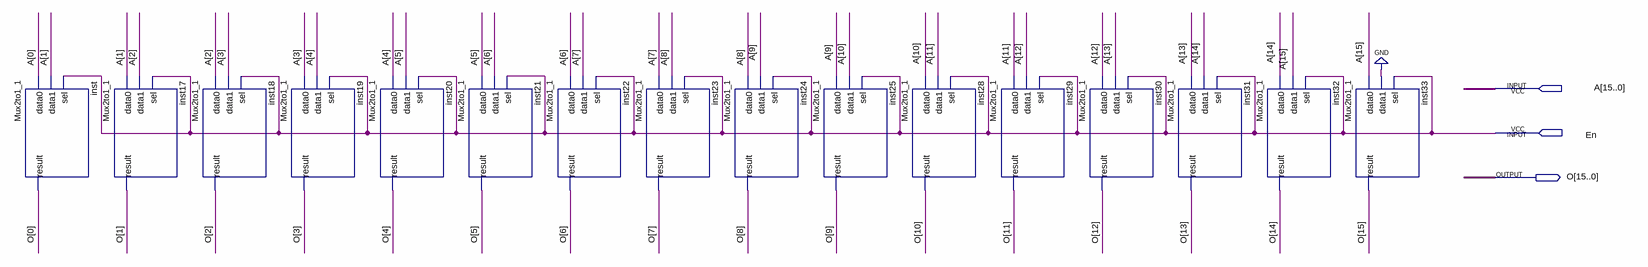
[diagram p0: schematic sheet]
// Quartus schematic shfr.bdf as structural Verilog: 16 symbols, 3 pins
module shfr (
  input  [15:0] A,
  input  En,
  output [15:0] O
);

  Mux2to1_1 inst (.data0(A[0]), .data1(A[1]), .sel(En), .result(O[0]));
  Mux2to1_1 inst17 (.data0(A[1]), .data1(A[2]), .sel(En), .result(O[1]));
  Mux2to1_1 inst18 (.data0(A[2]), .data1(A[3]), .sel(En), .result(O[2]));
  Mux2to1_1 inst19 (.data0(A[3]), .data1(A[4]), .sel(En), .result(O[3]));
  Mux2to1_1 inst20 (.data0(A[4]), .data1(A[5]), .sel(En), .result(O[4]));
  Mux2to1_1 inst21 (.data0(A[5]), .data1(A[6]), .sel(En), .result(O[5]));
  Mux2to1_1 inst22 (.data0(A[6]), .data1(A[7]), .sel(En), .result(O[6]));
  Mux2to1_1 inst23 (.data0(A[7]), .data1(A[8]), .sel(En), .result(O[7]));
  Mux2to1_1 inst24 (.data0(A[8]), .data1(A[9]), .sel(En), .result(O[8]));
  Mux2to1_1 inst25 (.data0(A[9]), .data1(A[10]), .sel(En), .result(O[9]));
  Mux2to1_1 inst28 (.data0(A[10]), .data1(A[11]), .sel(En), .result(O[10]));
  Mux2to1_1 inst29 (.data0(A[11]), .data1(A[12]), .sel(En), .result(O[11]));
  Mux2to1_1 inst30 (.data0(A[12]), .data1(A[13]), .sel(En), .result(O[12]));
  Mux2to1_1 inst31 (.data0(A[13]), .data1(A[14]), .sel(En), .result(O[13]));
  Mux2to1_1 inst32 (.data0(A[14]), .data1(A[15]), .sel(En), .result(O[14]));
  Mux2to1_1 inst33 (.data0(A[15]), .data1(1'b0), .sel(En), .result(O[15]));
endmodule
